# Altium schematic sheet Principal.SchDoc: Levitador magnético
size A4; Date: 27/10/2020
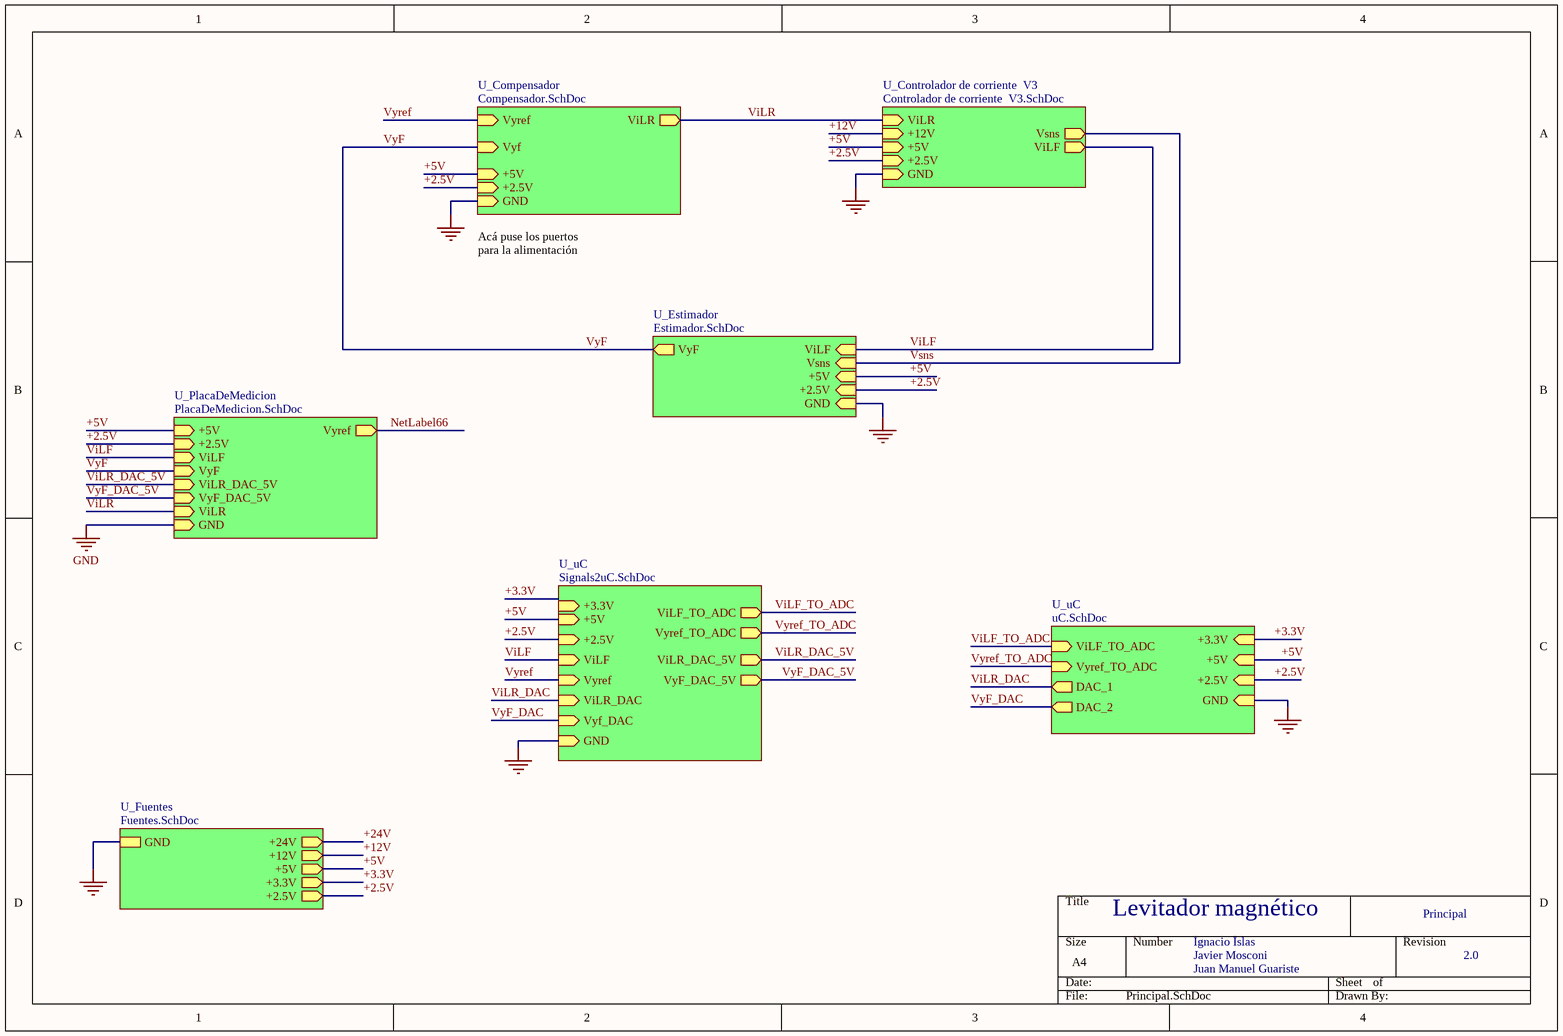
[diagram p0: Principal.SchDoc]

## Sub-sheets
U_Compensador = Compensador.SchDoc: Vyf (in), ViLR (out), Vyref (in), +5V (in), +2.5V (in), GND (in)
U_Controlador de corriente  V3 = Controlador de corriente  V3.SchDoc: ViLR (in), ViLF (out), Vsns (out), +2.5V (in), +5V (in), GND (in), +12V (in)
U_Estimador = Estimador.SchDoc: ViLF (in), Vsns (in), +5V (in), +2.5V (in), GND (in), VyF (out)
U_Fuentes = Fuentes.SchDoc: +12V (out), +5V (out), +2.5V (out), +24V (out), GND, +3.3V (out)
U_PlacaDeMedicion = PlacaDeMedicion.SchDoc: Vyref (out), +5V (in), +2.5V (in), ViLF (in), VyF (in), ViLR_DAC_5V (in), VyF_DAC_5V (in), GND (in), ViLR (in)
U_uC = Signals2uC.SchDoc: ViLF (in), +3.3V (in), +5V (in), +2.5V (in), GND (in), Vyref (in), ViLF_TO_ADC (out), Vyref_TO_ADC (out), ViLR_DAC (in), Vyf_DAC (in), ViLR_DAC_5V (out), VyF_DAC_5V (out)
U_uC = uC.SchDoc: +3.3V (in), +5V (in), +2.5V (in), GND (in), ViLF_TO_ADC (in), Vyref_TO_ADC (in), DAC_1 (out), DAC_2 (out)

## Nets
GND: sheet U_Controlador de corriente  V3/GND, sheet U_Fuentes/GND, sheet U_Compensador/GND, sheet U_Estimador/GND, sheet U_uC/GND, sheet U_uC/GND, sheet U_PlacaDeMedicion/GND
+2.5V: sheet U_Controlador de corriente  V3/+2.5V, sheet U_Fuentes/+2.5V, sheet U_Compensador/+2.5V, sheet U_Estimador/+2.5V, sheet U_uC/+2.5V, sheet U_uC/+2.5V, sheet U_PlacaDeMedicion/+2.5V
+3.3V: sheet U_Fuentes/+3.3V, sheet U_uC/+3.3V
+5V: sheet U_Controlador de corriente  V3/+5V, sheet U_Fuentes/+5V, sheet U_Compensador/+5V, sheet U_Estimador/+5V, sheet U_uC/+5V, sheet U_uC/+5V, sheet U_PlacaDeMedicion/+5V
+12V: sheet U_Controlador de corriente  V3/+12V, sheet U_Fuentes/+12V
+24V: sheet U_Fuentes/+24V
NetLabel66: sheet U_PlacaDeMedicion/Vyref
ViLF: sheet U_Controlador de corriente  V3/ViLF, sheet U_Estimador/ViLF, sheet U_uC/ViLF, sheet U_PlacaDeMedicion/ViLF
ViLF_TO_ADC: sheet U_uC/ViLF_TO_ADC, sheet U_uC/ViLF_TO_ADC
ViLR: sheet U_Controlador de corriente  V3/ViLR, sheet U_Compensador/ViLR, sheet U_PlacaDeMedicion/ViLR
ViLR_DAC: sheet U_uC/ViLR_DAC, sheet U_uC/DAC_1
ViLR_DAC_5V: sheet U_uC/ViLR_DAC_5V, sheet U_PlacaDeMedicion/ViLR_DAC_5V
Vsns: sheet U_Controlador de corriente  V3/Vsns, sheet U_Estimador/Vsns
VyF: sheet U_Compensador/Vyf, sheet U_Estimador/VyF, sheet U_PlacaDeMedicion/VyF
VyF_DAC: sheet U_uC/Vyf_DAC, sheet U_uC/DAC_2
VyF_DAC_5V: sheet U_uC/VyF_DAC_5V, sheet U_PlacaDeMedicion/VyF_DAC_5V
Vyref: sheet U_Compensador/Vyref, sheet U_uC/Vyref
Vyref_TO_ADC: sheet U_uC/Vyref_TO_ADC, sheet U_uC/Vyref_TO_ADC

## Notes on the sheet
- Acá puse los puertos para la alimentación
- Principal
- Ignacio Islas
- Javier Mosconi
- Juan Manuel Guariste
- 2.0